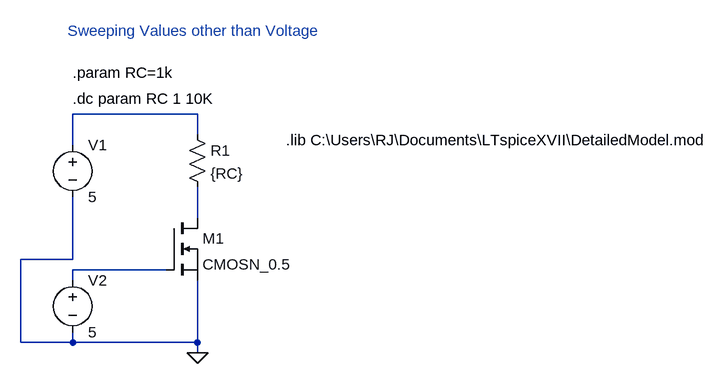
[diagram p0: schematic sweeping_non_voltages.asc]
sweeping_non_voltages.asc, the LTspice schematic file:
Version 4
SHEET 1 1036 680
WIRE 176 176 -16 176
WIRE 176 208 176 176
WIRE -16 224 -16 176
WIRE 176 336 176 288
WIRE -16 400 -16 304
WIRE -16 400 -96 400
WIRE 128 416 -16 416
WIRE -16 432 -16 416
WIRE -96 528 -96 400
WIRE -16 528 -16 512
WIRE -16 528 -96 528
WIRE 176 528 176 432
WIRE 176 528 -16 528
WIRE 176 544 176 528
FLAG 176 544 0
SYMBOL voltage -16 208 R0
SYMATTR InstName V1
SYMATTR Value 5
SYMBOL res 160 192 R0
SYMATTR InstName R1
SYMATTR Value {RC}
SYMBOL nmos 128 336 R0
SYMATTR InstName M1
SYMATTR Value CMOSN_0.5
SYMBOL voltage -16 416 R0
SYMATTR InstName V2
SYMATTR Value 5
TEXT -24 48 Left 2 ;Sweeping Values other than Voltage
TEXT -16 112 Left 2 !.param RC=1k
TEXT 312 216 Left 2 !.lib C:\\Users\\RJ\\Documents\\LTspiceXVII\\DetailedModel.mod
TEXT -16 152 Left 2 !.dc param RC 1 10K

The netlist it stands for:
* sweeping_non_voltages.asc
V1 N001 0 5
R1 N001 N002 {RC}
M1 N002 N003 0 0 CMOSN_0.5
V2 N003 0 5
.model NMOS NMOS
.model PMOS PMOS
.lib standard.mos
* Sweeping Values other than Voltage
.param RC=1k
.lib C:\Users\RJ\Documents\LTspiceXVII\DetailedModel.mod
.dc param RC 1 10K
.backanno
.end